# EAGLE schematic bms_ver0.2 (EAGLE 7.7.0)
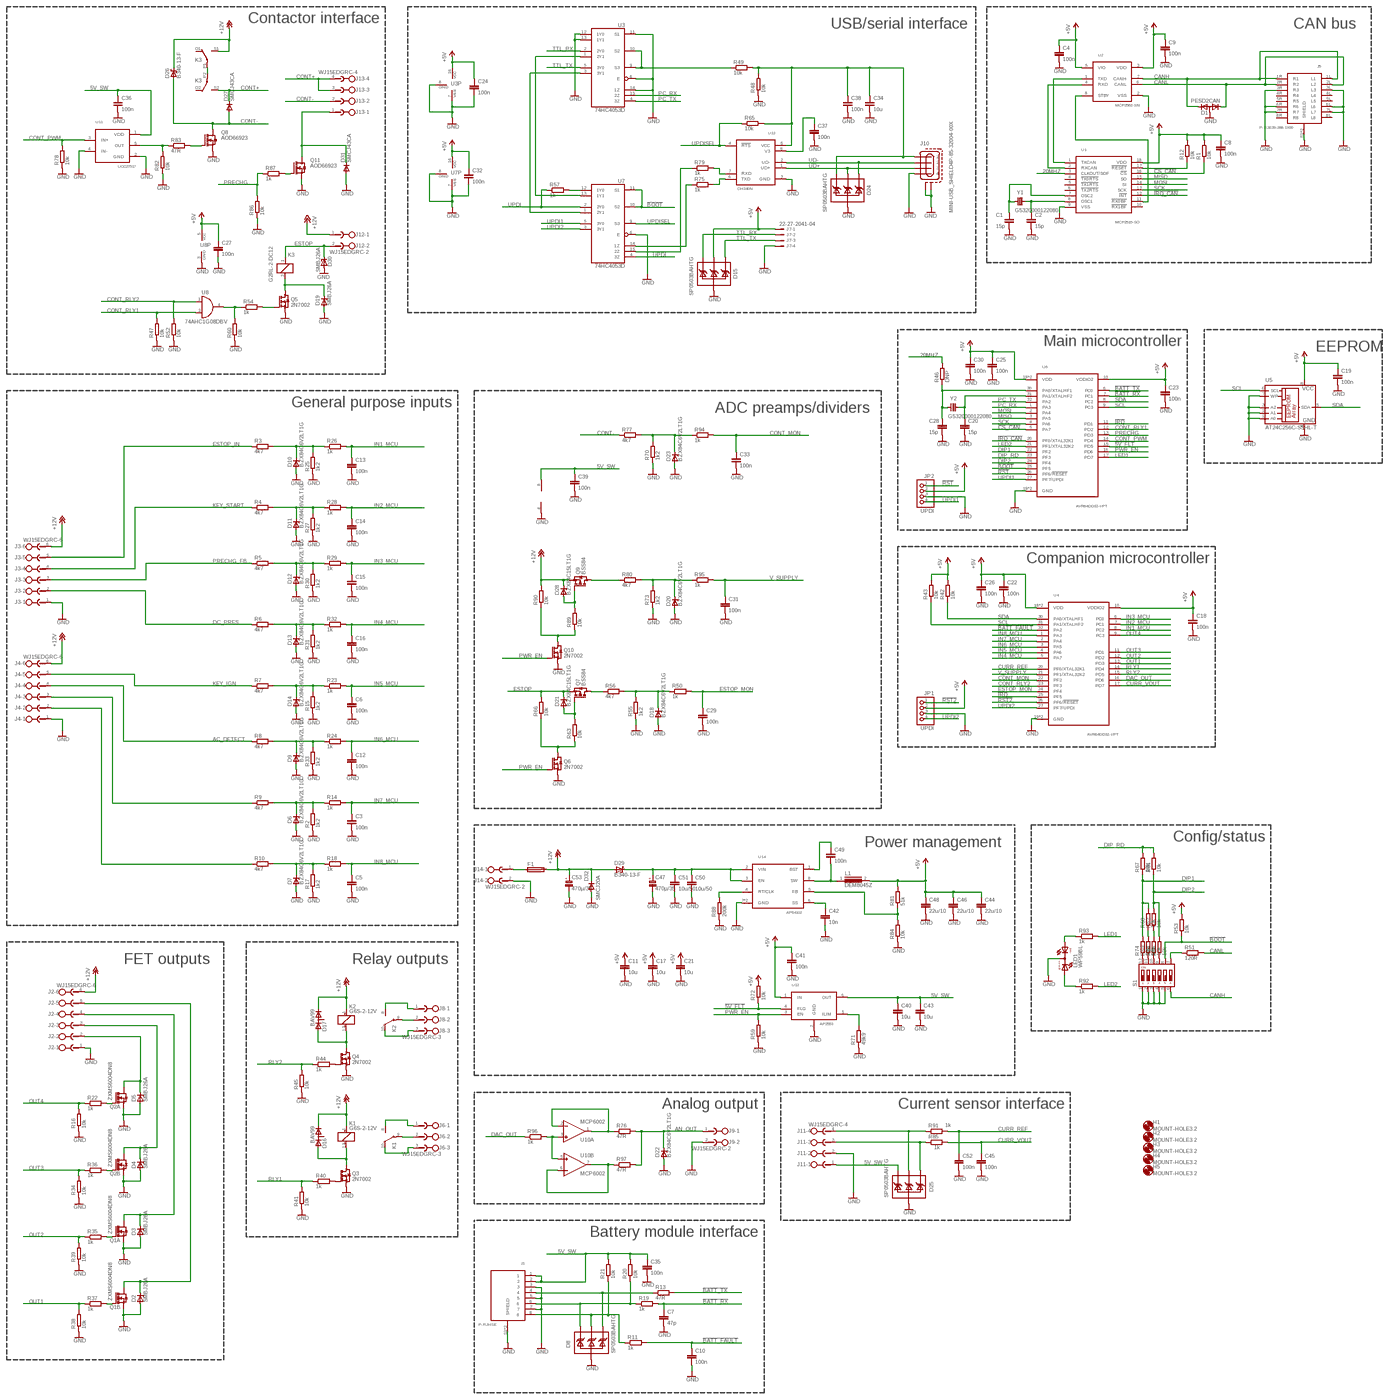
[diagram p0: schematic, sheet 1, overview]
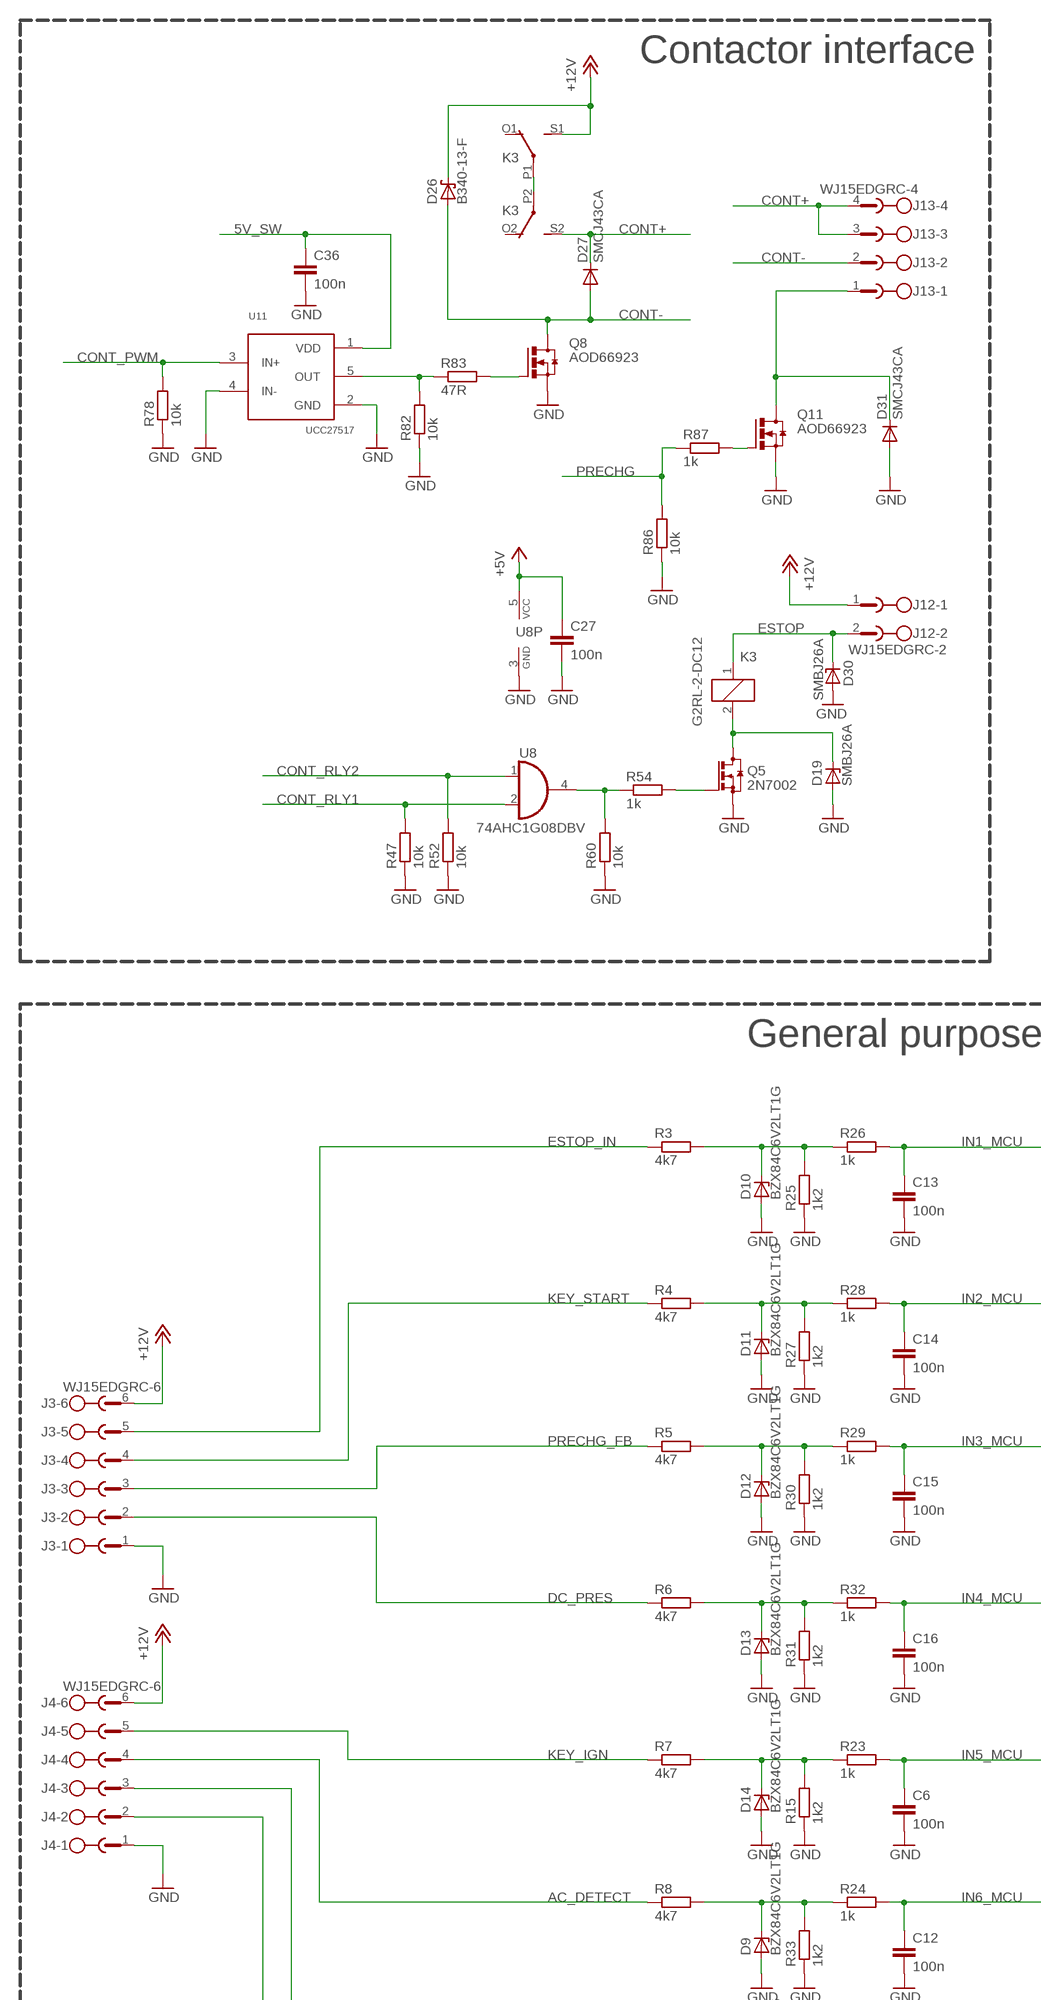
[diagram p1: schematic, sheet 1, part 1 of 4]
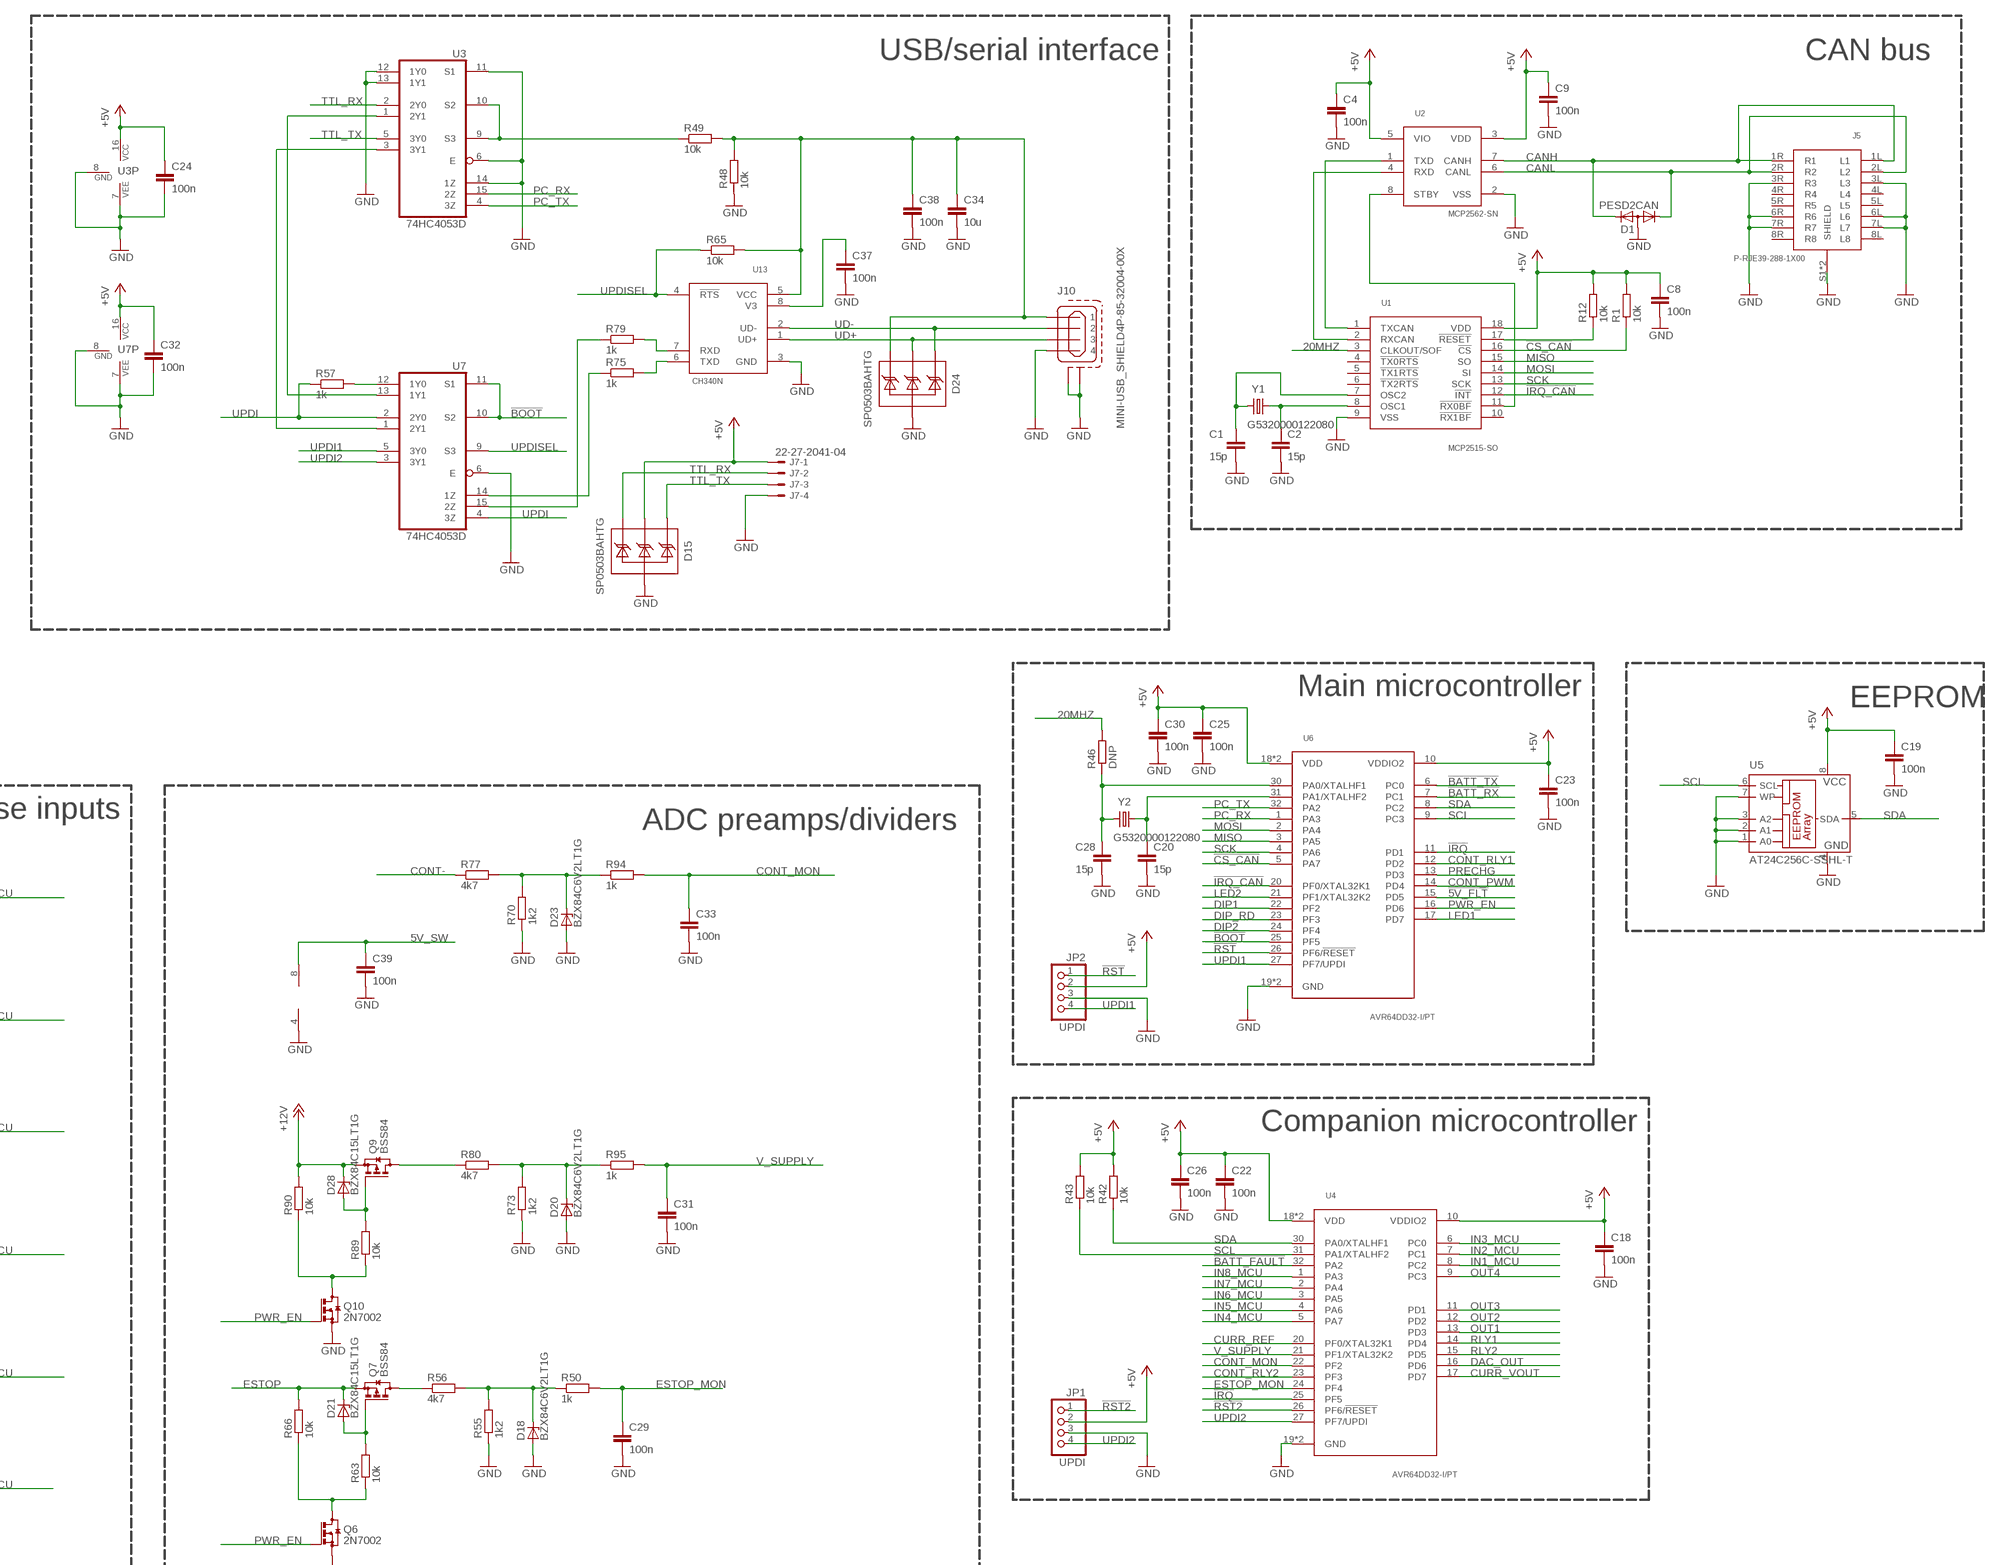
[diagram p2: schematic, sheet 1, part 2 of 4]
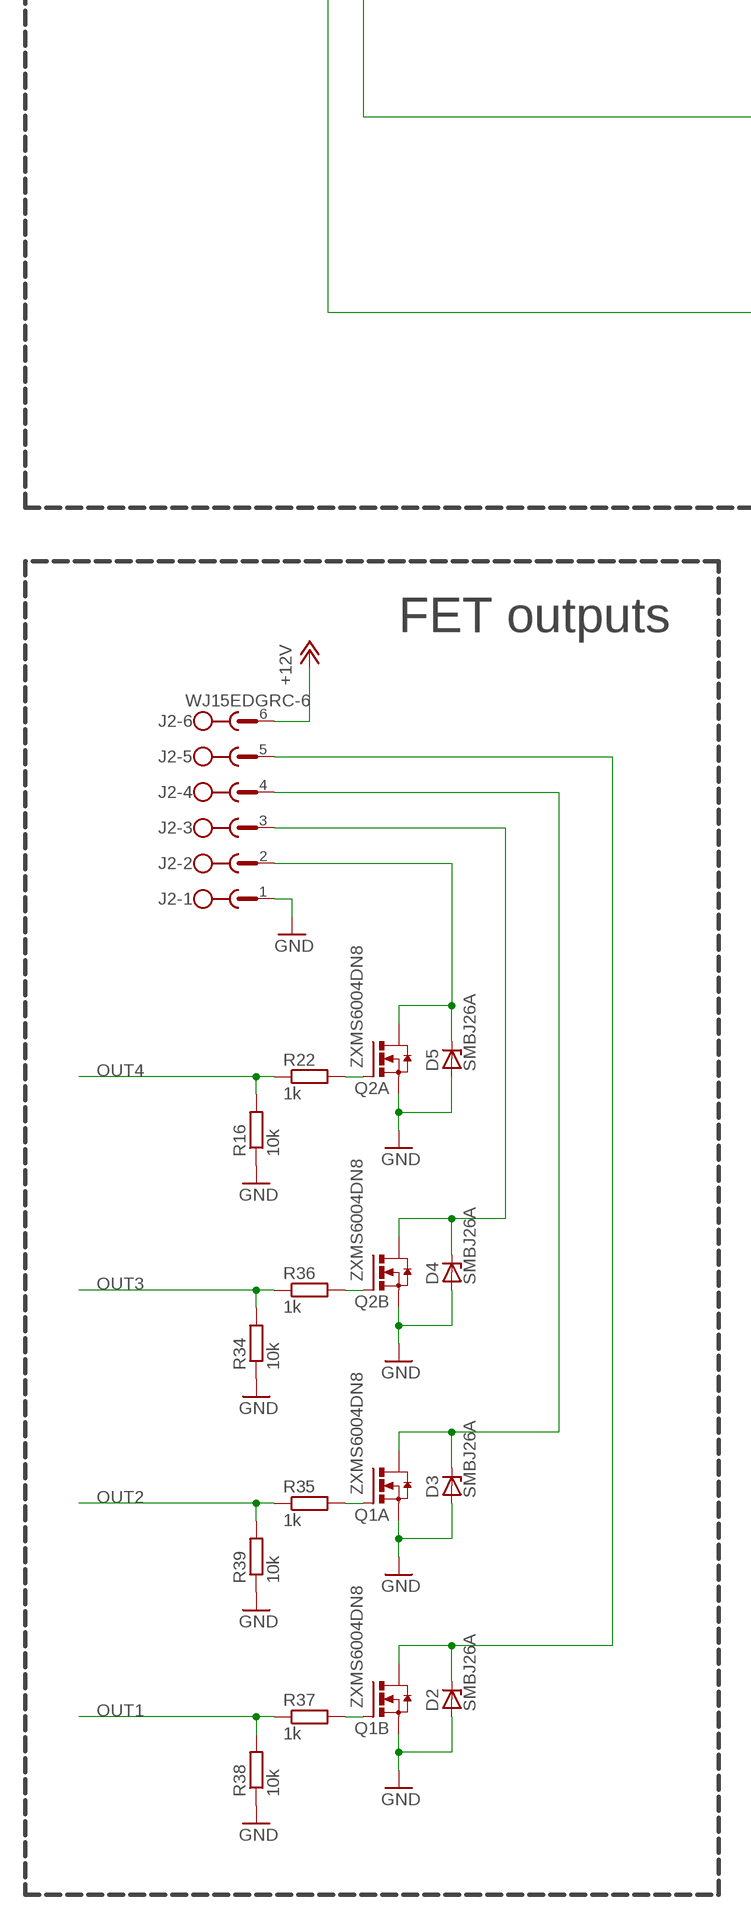
[diagram p3: schematic, sheet 1, part 3 of 4]
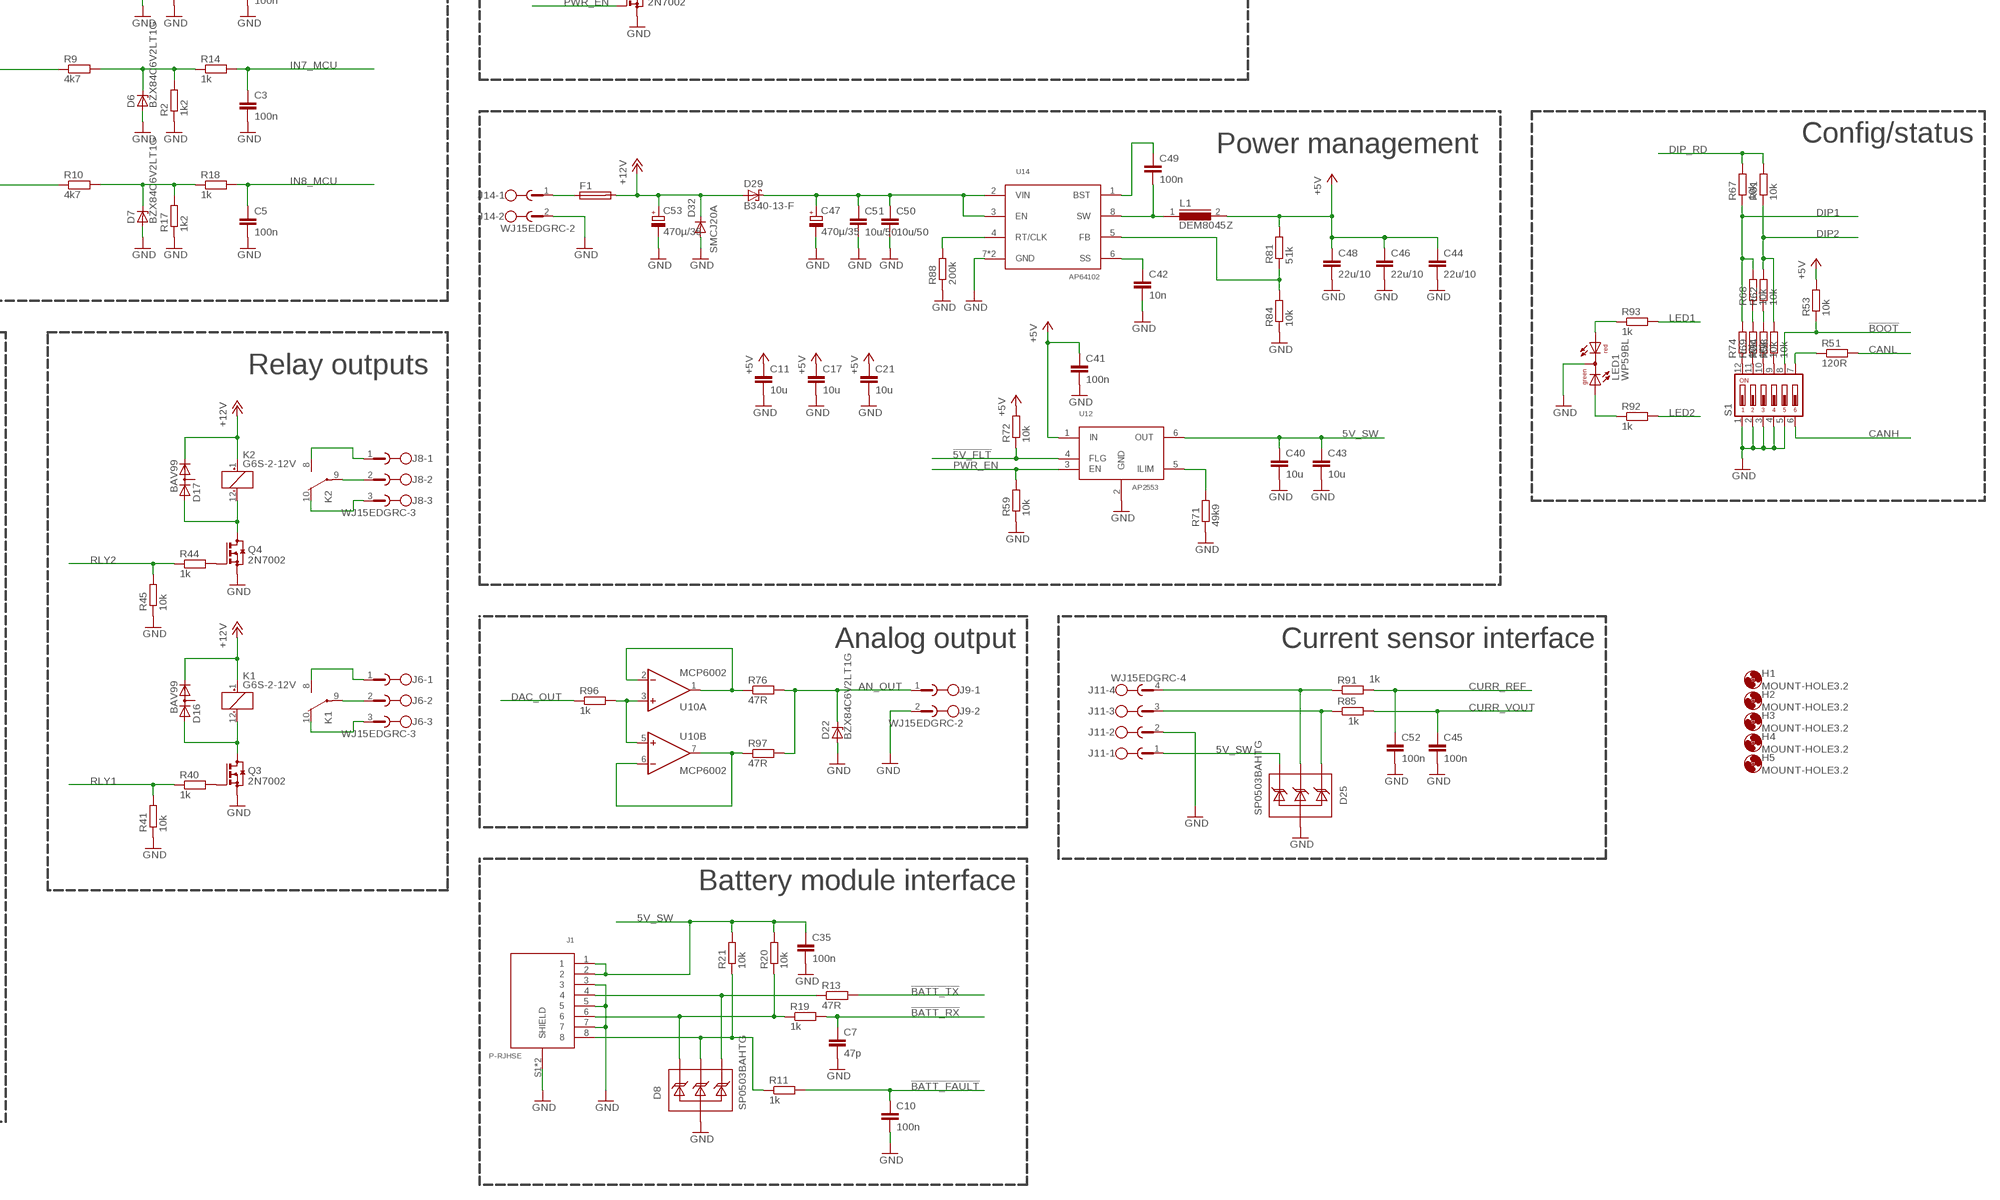
[diagram p4: schematic, sheet 1, part 4 of 4]

## Parts
C1  15p  C-EUC0805K  [C0805K]
C2  15p  C-EUC0805K  [C0805K]
C3  100n  C-EUC0805K  [C0805K]
C4  100n  C-EUC0805K  [C0805K]
C5  100n  C-EUC0805K  [C0805K]
C6  100n  C-EUC0805K  [C0805K]
C7  47p  C-EUC0805K  [C0805K]
C8  100n  C-EUC0805K  [C0805K]
C9  100n  C-EUC0805K  [C0805K]
C10  100n  C-EUC0805K  [C0805K]
C11  10u  C-EUC1206K  [C1206K]
C12  100n  C-EUC0805K  [C0805K]
C13  100n  C-EUC0805K  [C0805K]
C14  100n  C-EUC0805K  [C0805K]
C15  100n  C-EUC0805K  [C0805K]
C16  100n  C-EUC0805K  [C0805K]
C17  10u  C-EUC1206K  [C1206K]
C18  100n  C-EUC0805K  [C0805K]
C19  100n  C-EUC0805K  [C0805K]
C20  15p  C-EUC0805K  [C0805K]
C21  10u  C-EUC1206K  [C1206K]
C22  100n  C-EUC0805K  [C0805K]
C23  100n  C-EUC0805K  [C0805K]
C24  100n  C-EUC0805K  [C0805K]
C25  100n  C-EUC0805K  [C0805K]
C26  100n  C-EUC0805K  [C0805K]
C27  100n  C-EUC0805K  [C0805K]
C28  15p  C-EUC0805K  [C0805K]
C29  100n  C-EUC0805K  [C0805K]
C30  100n  C-EUC0805K  [C0805K]
C31  100n  C-EUC0805K  [C0805K]
C32  100n  C-EUC0805K  [C0805K]
C33  100n  C-EUC0805K  [C0805K]
C34  10u  C-EUC1206K  [C1206K]
C35  100n  C-EUC0805K  [C0805K]
C36  100n  C-EUC0805K  [C0805K]
C37  100n  C-EUC0805K  [C0805K]
C38  100n  C-EUC0805K  [C0805K]
C39  100n  C-EUC0805K  [C0805K]
C40  10u  C-EUC1206K  [C1206K]
C41  100n  C-EUC0805K  [C0805K]
C42  10n  C-EUC0805K  [C0805K]
C43  10u  C-EUC1206K  [C1206K]
C44  22u/10  C-EUC1206K  [C1206K]
C45  100n  C-EUC0805K  [C0805K]
C46  22u/10  C-EUC1206K  [C1206K]
C47  470µ/35  CPOL-EUE5-10.5  [E5-10,5]
C48  22u/10  C-EUC1206K  [C1206K]
C49  100n  C-EUC0805K  [C0805K]
C50  10u/50  C-EUC1206K  [C1206K]
C51  10u/50  C-EUC1206K  [C1206K]
C52  100n  C-EUC0805K  [C0805K]
C53  470µ/35  CPOL-EUE5-10.5  [E5-10,5]
D1  PESD2CAN  DIODE-2CA|ACSOT23  [SOT23]
D2  SMBJ26A  ZENER-DIODESMB  [SMB]
D3  SMBJ26A  ZENER-DIODESMB  [SMB]
D4  SMBJ26A  ZENER-DIODESMB  [SMB]
D5  SMBJ26A  ZENER-DIODESMB  [SMB]
D6  BZX84C6V2LT1G  ZENER-DIODESOT23  [SOT23]
D7  BZX84C6V2LT1G  ZENER-DIODESOT23  [SOT23]
D8  SP0503BAHTG  [SOT143]
D9  BZX84C6V2LT1G  ZENER-DIODESOT23  [SOT23]
D10  BZX84C6V2LT1G  ZENER-DIODESOT23  [SOT23]
D11  BZX84C6V2LT1G  ZENER-DIODESOT23  [SOT23]
D12  BZX84C6V2LT1G  ZENER-DIODESOT23  [SOT23]
D13  BZX84C6V2LT1G  ZENER-DIODESOT23  [SOT23]
D14  BZX84C6V2LT1G  ZENER-DIODESOT23  [SOT23]
D15  SP0503BAHTG  [SOT143]
D16  BAV99  BAV199  [SOT23]
D17  BAV99  BAV199  [SOT23]
D18  BZX84C6V2LT1G  ZENER-DIODESOT23  [SOT23]
D19  SMBJ26A  ZENER-DIODESMB  [SMB]
D20  BZX84C6V2LT1G  ZENER-DIODESOT23  [SOT23]
D21  BZX84C15LT1G  ZENER-DIODESOT23  [SOT23]
D22  BZX84C6V2LT1G  ZENER-DIODESOT23  [SOT23]
D23  BZX84C6V2LT1G  ZENER-DIODESOT23  [SOT23]
D24  SP0503BAHTG  [SOT143]
D25  SP0503BAHTG  [SOT143]
D26  B340-13-F  SCHOTTKY-DIODESMC  [SMC]
D27  SMCJ43CA  DIODE-SMC  [SMC]
D28  BZX84C15LT1G  ZENER-DIODESOT23  [SOT23]
D29  B340-13-F  SCHOTTKY-DIODESMC  [SMC]
D30  SMBJ26A  ZENER-DIODESMB  [SMB]
D31  SMCJ43CA  DIODE-SMC  [SMC]
D32  SMCJ20A  DIODE-SMC  [SMC]
F1  3568  [3568]
H1  MOUNT-HOLE3.2  [3,2]
H2  MOUNT-HOLE3.2  [3,2]
H3  MOUNT-HOLE3.2  [3,2]
H4  MOUNT-HOLE3.2  [3,2]
H5  MOUNT-HOLE3.2  [3,2]
J1  P-RJHSE  [P-RJHSE]
J2  WJ15EDGRC-6  [WJ15EDGRC-3.81-6]
J3  WJ15EDGRC-6  [WJ15EDGRC-3.81-6]
J4  WJ15EDGRC-6  [WJ15EDGRC-3.81-6]
J5  P-RJE39-288-1X00  [P-RJE39-288-1X00]
J6  WJ15EDGRC-3  [WJ15EDGRC-3.81-3]
J7  22-27-2041-04  [6410-04]
J8  WJ15EDGRC-3  [WJ15EDGRC-3.81-3]
J9  WJ15EDGRC-2  [WJ15EDGRC-3.81-2]
J10  MINI-USB_SHIELD4P-85-32004-00X  [85-32004-00X]
J11  WJ15EDGRC-4  [WJ15EDGRC-3.81-4]
J12  WJ15EDGRC-2  [WJ15EDGRC-3.81-2]
J13  WJ15EDGRC-4  [WJ15EDGRC-3.81-4]
J14  WJ15EDGRC-2  [WJ15EDGRC-3.81-2]
JP1  UPDI  PINHD-1X4  [1X04]
JP2  UPDI  PINHD-1X4  [1X04]
K1  G6S-2-12V  TXS2-12V  [TXD2]
K2  G6S-2-12V  TXS2-12V  [TXD2]
K3  G2RL-2-DC12  G2R2  [G2R2]
L1  DEM8045Z  [DEM8045Z]
LED1  WP59BL  [WP59BL]
Q1  ZXMS6004DN8  IRF8313P  [SO-08]
Q2  ZXMS6004DN8  IRF8313P  [SO-08]
Q3  2N7002  BSS123  [SOT23]
Q4  2N7002  BSS123  [SOT23]
Q5  2N7002  BSS123  [SOT23]
Q6  2N7002  BSS123  [SOT23]
Q7  BSS84  [SOT23]
Q8  AOD66923  N-MOSFETR  [D-PAK_TO252AA]
Q9  BSS84  [SOT23]
Q10  2N7002  BSS123  [SOT23]
Q11  AOD66923  N-MOSFETR  [D-PAK_TO252AA]
R1  10k  R-EU_R0805  [R0805]
R2  1k2  R-EU_R0805  [R0805]
R3  4k7  R-EU_R1206  [R1206]
R4  4k7  R-EU_R1206  [R1206]
R5  4k7  R-EU_R1206  [R1206]
R6  4k7  R-EU_R1206  [R1206]
R7  4k7  R-EU_R1206  [R1206]
R8  4k7  R-EU_R1206  [R1206]
R9  4k7  R-EU_R1206  [R1206]
R10  4k7  R-EU_R1206  [R1206]
R11  1k  R-EU_R0805  [R0805]
R12  10k  R-EU_R0805  [R0805]
R13  47R  R-EU_R0805  [R0805]
R14  1k  R-EU_R0805  [R0805]
R15  1k2  R-EU_R0805  [R0805]
R16  10k  R-EU_R0805  [R0805]
R17  1k2  R-EU_R0805  [R0805]
R18  1k  R-EU_R0805  [R0805]
R19  1k  R-EU_R0805  [R0805]
R20  10k  R-EU_R0805  [R0805]
R21  10k  R-EU_R0805  [R0805]
R22  1k  R-EU_R0805  [R0805]
R23  1k  R-EU_R0805  [R0805]
R24  1k  R-EU_R0805  [R0805]
R25  1k2  R-EU_R0805  [R0805]
R26  1k  R-EU_R0805  [R0805]
R27  1k2  R-EU_R0805  [R0805]
R28  1k  R-EU_R0805  [R0805]
R29  1k  R-EU_R0805  [R0805]
R30  1k2  R-EU_R0805  [R0805]
R31  1k2  R-EU_R0805  [R0805]
R32  1k  R-EU_R0805  [R0805]
R33  1k2  R-EU_R0805  [R0805]
R34  10k  R-EU_R0805  [R0805]
R35  1k  R-EU_R0805  [R0805]
R36  1k  R-EU_R0805  [R0805]
R37  1k  R-EU_R0805  [R0805]
R38  10k  R-EU_R0805  [R0805]
R39  10k  R-EU_R0805  [R0805]
R40  1k  R-EU_R0805  [R0805]
R41  10k  R-EU_R0805  [R0805]
R42  10k  R-EU_R0805  [R0805]
R43  10k  R-EU_R0805  [R0805]
R44  1k  R-EU_R0805  [R0805]
R45  10k  R-EU_R0805  [R0805]
R46  DNP  R-EU_R0805  [R0805]
R47  10k  R-EU_R0805  [R0805]
R48  10k  R-EU_R0805  [R0805]
R49  10k  R-EU_R0805  [R0805]
R50  1k  R-EU_R0805  [R0805]
R51  120R  R-EU_R1210  [R1210]
R52  10k  R-EU_R0805  [R0805]
R53  10k  R-EU_R0805  [R0805]
R54  1k  R-EU_R0805  [R0805]
R55  1k2  R-EU_R0805  [R0805]
R56  4k7  R-EU_R1206  [R1206]
R57  1k  R-EU_R0805  [R0805]
R58  10k  R-EU_R0805  [R0805]
R59  10k  R-EU_R0805  [R0805]
R60  10k  R-EU_R0805  [R0805]
R61  10k  R-EU_R0805  [R0805]
R62  10k  R-EU_R0805  [R0805]
R63  10k  R-EU_R0805  [R0805]
R64  10k  R-EU_R0805  [R0805]
R65  10k  R-EU_R0805  [R0805]
R66  10k  R-EU_R0805  [R0805]
R67  10k  R-EU_R0805  [R0805]
R68  10k  R-EU_R0805  [R0805]
R69  10k  R-EU_R0805  [R0805]
R70  1k2  R-EU_R0805  [R0805]
R71  49k9  R-EU_R0805  [R0805]
R72  10k  R-EU_R0805  [R0805]
R73  1k2  R-EU_R0805  [R0805]
R74  10k  R-EU_R0805  [R0805]
R75  1k  R-EU_R0805  [R0805]
R76  47R  R-EU_R0805  [R0805]
R77  4k7  R-EU_R1206  [R1206]
R78  10k  R-EU_R0805  [R0805]
R79  1k  R-EU_R0805  [R0805]
R80  4k7  R-EU_R1206  [R1206]
R81  51k  R-EU_R0805  [R0805]
R82  10k  R-EU_R0805  [R0805]
R83  47R  R-EU_R0805  [R0805]
R84  10k  R-EU_R0805  [R0805]
R85  1k  R-EU_R0805  [R0805]
R86  10k  R-EU_R0805  [R0805]
R87  1k  R-EU_R0805  [R0805]
R88  200k  R-EU_R0805  [R0805]
R89  10k  R-EU_R0805  [R0805]
R90  10k  R-EU_R0805  [R0805]
R91  1k  R-EU_R0805  [R0805]
R92  1k  R-EU_R0805  [R0805]
R93  1k  R-EU_R0805  [R0805]
R94  1k  R-EU_R0805  [R0805]
R95  1k  R-EU_R0805  [R0805]
R96  1k  R-EU_R0805  [R0805]
R97  47R  R-EU_R0805  [R0805]
S1  DA06  [DA-06]
U1  MCP2515-SO  [SO-18DW]
U2  MCP2562-SN  [SO-08]
U3  74HC4053D  744053D  [SO16]
U4  AVR64DD32-I/PT  AVR64DD32/32-PT  [TQFP32-08]
U5  AT24C256C-SSHL-T  24AA256SN  [SO-08]
U6  AVR64DD32-I/PT  AVR64DD32/32-PT  [TQFP32-08]
U7  74HC4053D  744053D  [SO16]
U8  74AHC1G08DBV  [SOT23-5]
U10  MCP6002  MCP602SN  [SO08]
U11  UCC27517  [SOT23-5L]
U12  AP2553  [SOT23-6L]
U13  CH340N  CH330N  [SO-08]
U14  AP64102  AP64352  [SO08-EP]
Y1  G5320000122080  CRYSTALTXC-7A  [CRYSTAL-TXC-7A]
Y2  G5320000122080  CRYSTALTXC-7A  [CRYSTAL-TXC-7A]

## Nets
5V_SW: C35.1 C36.1 C39.1 C40.1 C43.1 D25.4(C3) J1.1 J1.2 J11.1 R20.2 R21.2 U10.8(P:V+) U11.1(VDD) U12.6(OUT)
20MHZ: R46.2 U1.3(CLKOUT/SOF)
!5V_FLT: R72.1 U6.15(PD5) U12.4(FLG)
!BATT_FAULT: C10.1 R11.2 U4.32(PA2)
!BATT_FAULT_E: D8.3(C2) J1.8 R11.1 R21.1
!BATT_RX: C7.1 R19.2 U6.7(PC1)
!BATT_RX_E: D8.2(C1) J1.6 R19.1 R20.1
!BATT_TX: R13.2 U6.6(PC0)
!BATT_TX_E: D8.4(C3) J1.4 R13.1
!BOOT: R53.1 S1.8 U6.25(PF5) U7.10(S2) U7.11(S1)
!CS_CAN: R1.1 U1.16(!CS) U6.5(PA7)
!IRQ: U4.25(PF5) U6.11(PD1)
!IRQ_CAN: U1.12(!INT) U6.20(PF0/XTAL32K1)
!RST: JP2.1 U6.26(PF6/!RESET)
!RST2: JP1.1 U4.26(PF6/!RESET)
+5V: C4.1 C8.1 C9.1 C11.1 C17.1 C18.1 C19.1 C21.1 C22.1 C23.1 C24.1 C25.1 C26.1 C27.1 C30.1 C32.1 C41.1 C44.1 C46.1 C48.1 D15.3(C2) J7.1 JP1.2 JP2.2 L1.2 R1.2 R12.2 R42.2 R43.2 R53.2 R72.2 R81.2 U1.18(VDD) U2.3(VDD) U2.5(VIO) U3.16(VCC) U4.10(VDDIO2) U4.18(VDD) U4.28(VDD) U5.8(VCC) U6.10(VDDIO2) U6.18(VDD) U6.28(VDD) U7.16(VCC) U8.5(VCC) U12.1(IN)
+12V: C53.+ D16.2(C) D17.2(C) D26.C D28.3(C) D29.A D32.C F1.2A F1.2B J2.6 J3.6 J4.6 J12.1 K1.1(_:+) K2.1(_:+) K3.S1(2:S) Q9.2(S) R90.2
AC_DETECT: J4.4 R8.1
AC_DETECT_F: D9.3(C) R8.2 R24.1 R33.2
AN_OUT: D22.3(C) J9.1 R76.2 R97.2
CANH: D1.2(K2) J5.1L(L1) J5.1R(R1) S1.6 U2.7(CANH)
CANL: D1.1(K1) J5.2L(L2) J5.2R(R2) R51.2 U2.6(CANL)
CONT+: D27.C J13.3 J13.4 K3.S2(3:S)
CONT-: D26.A D27.A J13.2 Q8.4(D) R77.1
CONT_MON: C33.1 R94.2 U4.22(PF2)
CONT_PWM: R78.2 U6.14(PD4) U11.3(IN+)
CONT_RLY1: R47.2 U6.12(PD2) U8.2(I1)
CONT_RLY2: R52.2 U4.23(PF3) U8.1(I0)
CURR_REF: C52.1 R91.2 U4.20(PF0/XTAL32K1)
CURR_VOUT: C45.1 R85.2 U4.17(PD7)
DAC_OUT: R96.1 U4.16(PD6)
DC_PRES: J3.2 R6.1
DC_PRES_F: D13.3(C) R6.2 R31.2 R32.1
DIP1: R67.1 R68.2 R74.2 U6.22(PF2)
DIP2: R58.2 R61.1 R62.2 U6.24(PF4)
DIP_RD: R61.2 R67.2 U6.23(PF3)
ESTOP: D21.3(C) D30.C J12.2 K3.1 Q7.2(S) R66.2
ESTOP_IN: J3.5 R3.1
ESTOP_MON: C29.1 R50.2 U4.24(PF4)
GND: C1.2 C2.2 C3.2 C4.2 C5.2 C6.2 C7.2 C8.2 C9.2 C10.2 C11.2 C12.2 C13.2 C14.2 C15.2 C16.2 C17.2 C18.2 C19.2 C20.2 C21.2 C22.2 C23.2 C24.2 C25.2 C26.2 C27.2 C28.2 C29.2 C30.2 C31.2 C32.2 C33.2 C34.2 C35.2 C36.2 C37.2 C38.2 C39.2 C40.2 C41.2 C42.2 C43.2 C44.2 C45.2 C46.2 C47.- C48.2 C50.2 C51.2 C52.2 C53.- D1.3(A) D2.A D3.A D4.A D5.A D6.1(A) D7.1(A) D8.1(A) D9.1(A) D10.1(A) D11.1(A) D12.1(A) D13.1(A) D14.1(A) D15.1(A) D18.1(A) D19.A D20.1(A) D22.1(A) D23.1(A) D24.1(A) D25.1(A) D30.A D31.A D32.A J1.3 J1.5 J1.7 J1.S1(SHIELD) J1.S2(SHIELD) J2.1 J3.1 J4.1 J5.3L(L3) J5.3R(R3) J5.6L(L6) J5.6R(R6) J5.7L(L7) J5.7R(R7) J5.S1(SHIELD) J5.S2(SHIELD) J7.4 J9.2 J10.4 J10.M1(S1) J10.M2(S2) J11.2 J14.2 JP1.3 JP2.3 LED1.2(C) Q1.1(B:S) Q1.3(A:S) Q2.1(B:S) Q2.3(A:S) Q3.2(S) Q4.2(S) Q5.2(S) Q6.2(S) Q8.3(S) Q10.2(S) Q11.3(S) R2.1 R15.1 R16.1 R17.1 R25.1 R27.1 R30.1 R31.1 R33.1 R34.1 R38.1 R39.1 R41.1 R45.1 R47.1 R48.1 R52.1 R55.1 R59.1 R60.1 R70.1 R71.1 R73.1 R78.1 R82.1 R84.1 R86.1 R88.1 S1.1 S1.2 S1.3 S1.4 S1.5 U1.9(VSS) U2.2(VSS) U3.6(E) U3.7(VEE) U3.8(GND) U3.11(S1) U3.12(1Y0) U3.13(1Y1) U3.14(1Z) U4.19(GND) U4.29(GND) U5.1(A0) U5.2(A1) U5.3(A2) U5.4(GND) U5.7(WP) U6.19(GND) U6.29(GND) U7.6(E) U7.7(VEE) U7.8(GND) U8.3(GND) U10.4(P:V-) U11.2(GND) U11.4(IN-) U12.2(GND) U13.3(GND) U14.7(GND) U14.PAD(GND)
GPI1_F: D6.3(C) R2.2 R9.2 R14.1
GPI2_F: D7.3(C) R10.2 R17.2 R18.1
IN1_MCU: C13.1 R26.2 U4.8(PC2)
IN2_MCU: C14.1 R28.2 U4.7(PC1)
IN3_MCU: C15.1 R29.2 U4.6(PC0)
IN4_MCU: C16.1 R32.2 U4.5(PA7)
IN5_MCU: C6.1 R23.2 U4.4(PA6)
IN6_MCU: C12.1 R24.2 U4.3(PA5)
IN7_MCU: C3.1 R14.2 U4.2(PA4)
IN8_MCU: C5.1 R18.2 U4.1(PA3)
KEY_IGN: J4.5 R7.1
KEY_IGN_F: D14.3(C) R7.2 R15.2 R23.1
KEY_START: J3.4 R4.1
LED1: R93.2 U6.17(PD7)
LED2: R92.2 U6.21(PF1/XTAL32K2)
MISO: U1.15(SO) U6.3(PA5)
MOSI: U1.14(SI) U6.2(PA4)
N$1: R69.1 S1.11
N$2: C1.1 U1.7(OSC2) Y1.P$2
N$3: C2.1 U1.8(OSC1) Y1.P$1
N$4: U1.1(TXCAN) U2.1(TXD)
N$5: U1.2(RXCAN) U2.4(RXD)
N$6: R74.1 S1.12
N$7: R51.1 S1.7
N$8: C37.1 U13.8(V3)
N$9: C28.1 R46.1 U6.30(PA0/XTALHF1) Y2.P$2
N$10: C20.1 U6.31(PA1/XTALHF2) Y2.P$1
N$11: R75.2 U13.6(TXD)
N$12: R75.1 U7.14(1Z)
N$13: R71.2 U12.5(ILIM)
N$14: R62.1 R64.2
N$15: F1.1A F1.1B J14.1
N$16: R82.2 R83.1 U11.5(OUT)
N$17: Q8.1(G) R83.2
N$18: R96.2 U10.3(A:+IN) U10.5(B:+IN)
N$19: J6.2 K1.9(P)
N$20: J6.1 K1.8(S)
N$21: LED1.3(AG) R92.1
N$22: R68.1 R69.2
N$23: LED1.1(AR) R93.1
N$24: R58.1 S1.9
N$25: R64.1 S1.10
N$26: R76.1 U10.1(A:OUT) U10.2(A:-IN)
N$27: R97.1 U10.6(B:-IN) U10.7(B:OUT)
N$28: C34.1 C38.1 D24.4(C3) J10.1 R48.2 R49.2 R65.2 U13.5(VCC)
N$29: D11.3(C) R4.2 R27.2 R28.1
N$30: D31.C J13.1 Q11.4(D)
N$31: D19.C K3.2 Q5.3(D)
N$32: R54.1 R60.2 U8.4(O)
N$33: Q4.1(G) R44.2
N$34: Q5.1(G) R54.2
N$35: D17.1(A) K2.12(_:-) Q4.3(D)
N$36: Q3.1(G) R40.2
N$37: D16.1(A) K1.12(_:-) Q3.3(D)
N$38: J8.2 K2.9(P)
N$39: J8.1 K2.8(S)
N$40: J8.3 K2.10(O)
N$41: R57.2 U7.12(1Y0)
N$42: K3.P1(2:P) K3.P2(3:P)
N$43: Q1.2(B:G) R37.2
N$44: D25.2(C1) J11.3 R85.1
N$45: D25.3(C2) J11.4 R91.1
N$46: J4.3 R9.1
N$47: J4.2 R10.1
N$48: Q9.3(D) R80.1
N$49: J6.3 K1.10(O)
N$50: R79.2 U13.7(RXD)
N$51: Q11.1(G) R87.2
N$52: D12.3(C) R5.2 R29.1 R30.2
N$53: D18.3(C) R50.1 R55.2 R56.2
N$54: D28.1(A) Q9.1(G) R89.2
N$55: U3.1(2Y1) U7.13(1Y1)
N$56: U3.3(3Y1) U7.1(2Y1)
N$57: D10.3(C) R3.2 R25.2 R26.1
N$58: C49.1 U14.1(BST)
N$59: R12.1 U1.17(!RESET)
N$60: D20.3(C) R73.2 R80.2 R95.1
N$61: C49.2 L1.1 U14.8(SW)
N$62: D23.3(C) R70.2 R77.2 R94.1
N$63: Q10.3(D) R89.1 R90.1
N$64: D21.1(A) Q7.1(G) R63.2
N$65: R79.1 U7.15(2Z)
N$66: R49.1 U3.9(S3) U3.10(S2)
N$67: Q6.3(D) R63.1 R66.1
N$68: Q7.3(D) R56.1
N$69: R81.1 R84.2 U14.5(FB)
N$70: C42.1 U14.6(SS)
N$71: U1.11(!RX0BF) U2.8(STBY)
N$72: R88.2 U14.4(RT/CLK)
N$75: C47.+ C50.1 C51.1 D29.C U14.2(VIN) U14.3(EN)
N$81: D5.C J2.2 Q2.5(A:D) Q2.6(A:D)
N$82: D2.C J2.5 Q1.7(B:D) Q1.8(B:D)
N$83: D3.C J2.4 Q1.5(A:D) Q1.6(A:D)
N$84: D4.C J2.3 Q2.7(B:D) Q2.8(B:D)
N$88: Q2.4(A:G) R22.2
N$89: Q2.2(B:G) R36.2
N$90: Q1.4(A:G) R35.2
OUT1: R37.1 R38.2 U4.13(PD3)
OUT2: R35.1 R39.2 U4.12(PD2)
OUT3: R34.2 R36.1 U4.11(PD1)
OUT4: R16.2 R22.1 U4.9(PC3)
PC_RX: U3.15(2Z) U6.1(PA3)
PC_TX: U3.4(3Z) U6.32(PA2)
PRECHG: R86.2 R87.1 U6.13(PD3)
PRECHG_FB: J3.3 R5.1
PWR_EN: Q6.1(G) Q10.1(G) R59.2 U6.16(PD6) U12.3(EN)
RLY1: R40.1 R41.2 U4.14(PD4)
RLY2: R44.1 R45.2 U4.15(PD5)
SCK: U1.13(SCK) U6.4(PA6)
SCL: R43.1 U4.31(PA1/XTALHF2) U5.6(SCL) U6.9(PC3)
SDA: R42.1 U4.30(PA0/XTALHF1) U5.5(SDA) U6.8(PC2)
TTL_RX: D15.4(C3) J7.2 U3.2(2Y0)
TTL_TX: D15.2(C1) J7.3 U3.5(3Y0)
UD+: D24.3(C2) J10.3 U13.1(UD+)
UD-: D24.2(C1) J10.2 U13.2(UD-)
UPDI: R57.1 U7.2(2Y0) U7.4(3Z)
UPDI1: JP2.4 U6.27(PF7/UPDI) U7.5(3Y0)
UPDI2: JP1.4 U4.27(PF7/UPDI) U7.3(3Y1)
UPDISEL: R65.1 U7.9(S3) U13.4(!RTS)
V_SUPPLY: C31.1 R95.2 U4.21(PF1/XTAL32K2)
Unconnected: D16.3(AC) D17.3(AC) J5.4L(L4) J5.4R(R4) J5.5L(L5) J5.5R(R5) J5.8L(L8) J5.8R(R8) K1.3(O) K1.4(P) K1.5(S) K2.3(O) K2.4(P) K2.5(S) K3.O1(2:O) K3.O2(3:O) U1.4(!TX0RTS) U1.5(!TX1RTS) U1.6(!TX2RTS) U1.10(!RX1BF)

## Notes on the sheet
- Contactor interface
- USB/serial interface | CAN bus
- Main microcontroller
- EEPROM
- General purpose inputs
- ADC preamps/dividers
- Companion microcontroller
- Config/status
- Power management
- FET outputs | Relay outputs
- Analog output | Current sensor interface
- Battery module interface

## Library data of the parts
C1-C46 C48-C52 = rcl:C-EU: CAPACITOR, European symbol
C47 C53 = rcl:CPOL-EU: POLARIZED CAPACITOR, European symbol
D1 = diode:DIODE-2CA|AC: Dual DIODE Cathode-Anode|Anode-Cathode
D2-D7 D9-D14 D18-D23 D28 D30 = diode:ZENER-DIODE: Z-Diode
D8 D15 D24 D25 = SP0503BAHTG:SP0503BAHTG
D16 D17 = diode:BAV199: DIODE low-leakage double diode
D26 D29 = diode:SCHOTTKY-DIODE: Schottky Diode
D27 D31 D32 = diode:DIODE-: DIODE
F1 = 3568:3568
H1-H5 = holes:MOUNT-HOLE: MOUNTING HOLE with drill center marker
J1 = AMP RJ45:P-RJHSE
J2-J4 = WJ15EDGRC:WJ15EDGRC-6
J5 = AMP RJ45:P-RJE39-288-1X00
J6 J8 = WJ15EDGRC:WJ15EDGRC-3
J7 = con-molex:22-?-04: CONNECTOR wire to board 2.54 mm (.1 inch) pitch header; OC_FARNELL: unknown; OC_NEWARK: unknown
J9 J12 J14 = WJ15EDGRC:WJ15EDGRC-2
J10 = usb_dsp___:MINI-USB_SHIELD4P-: MINI USB 4 Pol. Source: www.cypressindustries.com; OC_FARNELL: unknown; OC_NEWARK: unknown
J11 J13 = WJ15EDGRC:WJ15EDGRC-4
JP1 JP2 = pinhead:PINHD-1X4: PIN HEADER
K1 K2 = relay:TX?-*: TX Relais NAiS TX-D RELAYS HIGH INSULATION Conforming to the supplementary insulation class of EN Standards (EN41003) Source: http://www.mew-europe.com/.. en_ds_61022_0007.pdf TX-S RELAYS SMALL POLARIZED RELAY WITH HIGH SENSITIVITY 50mW Source: http://www.mew-europe.com/.. en_ds_61022_0022.pdf; MPN: TXS2-12V; OC_FARNELL: unknown; OC_NEWARK: 13P9539
K3 = relay:G2R2: RELAY 2 x switch, Omron; MF: OMRON COMPONENTS USA; MPN: G2R-2-DC6; OC_FARNELL: unknown; OC_NEWARK: 89C5317
L1 = DEM8045Z:DEM8045Z
LED1 = WP59BL:WP59BL: Low Current (2mA) LED 3 mm Tinted Diffused Package color RED Source: Data sheet <http://www.farnell.com/datasheets/391100.pdf>; MF: VISHAY SEMICONDUCTOR; OC_FARNELL: 1612437
Q1 Q2 = transistor-power:IRF8313P: HEXFET(R) Power MOSFET Source: Data sheet <http://www.irf.com/product-info/datasheets/data/irf8313pbf.pdf>; MOUSER: 621-ZXMS6004DN8-13
Q3-Q6 Q10 = transistor-small-signal:BSS123: N-CHANNEL MOS FET
Q7 Q9 = transistor-small-signal:BSS84: P-CHANNEL MOS FET
Q8 Q11 = fet_252:N-MOSFET
R1-R97 = rcl:R-EU_: RESISTOR, European symbol
S1 = switch-dil:DA06: DIL/CODE SWITCH; MPN: MCDA06; OC_FARNELL: 9471553; OC_NEWARK: 26M1091
U1 = mcp2515:MCP2515
U2 = MCP2562:MCP2562
U3 U7 = 74xx-eu:74*4053: Triple 2-channel analog multiplexer/demultiplexer Philips Semiconductor
U4 U6 = AVR64DD32:AVR64DD32/32
U5 = microchip:24*: Serial EEPROM I2C; MPN: 24AA256T-I/SM; OC_FARNELL: 1579570; OC_NEWARK: 08N6838
U8 = 74xx-little-de:74*1G08: 2-input AND gate
U10 = linear:MCP602: Single Op Amp 2.7V to 6.0V Single Supply CMOS Source: http://ww1.microchip.com/downloads/en/DeviceDoc/21314g.pdf
U11 = UCC27517:UCC27517
U12 = AP2553:AP2553
U13 = CH330N:CH330N
U14 = AP64352:AP64352
Y1 Y2 = SparkFun-FreqCtrl:CRYSTAL: Various standard crystals. Proven footprints.